# Altium project STM32F4.PrjPcb
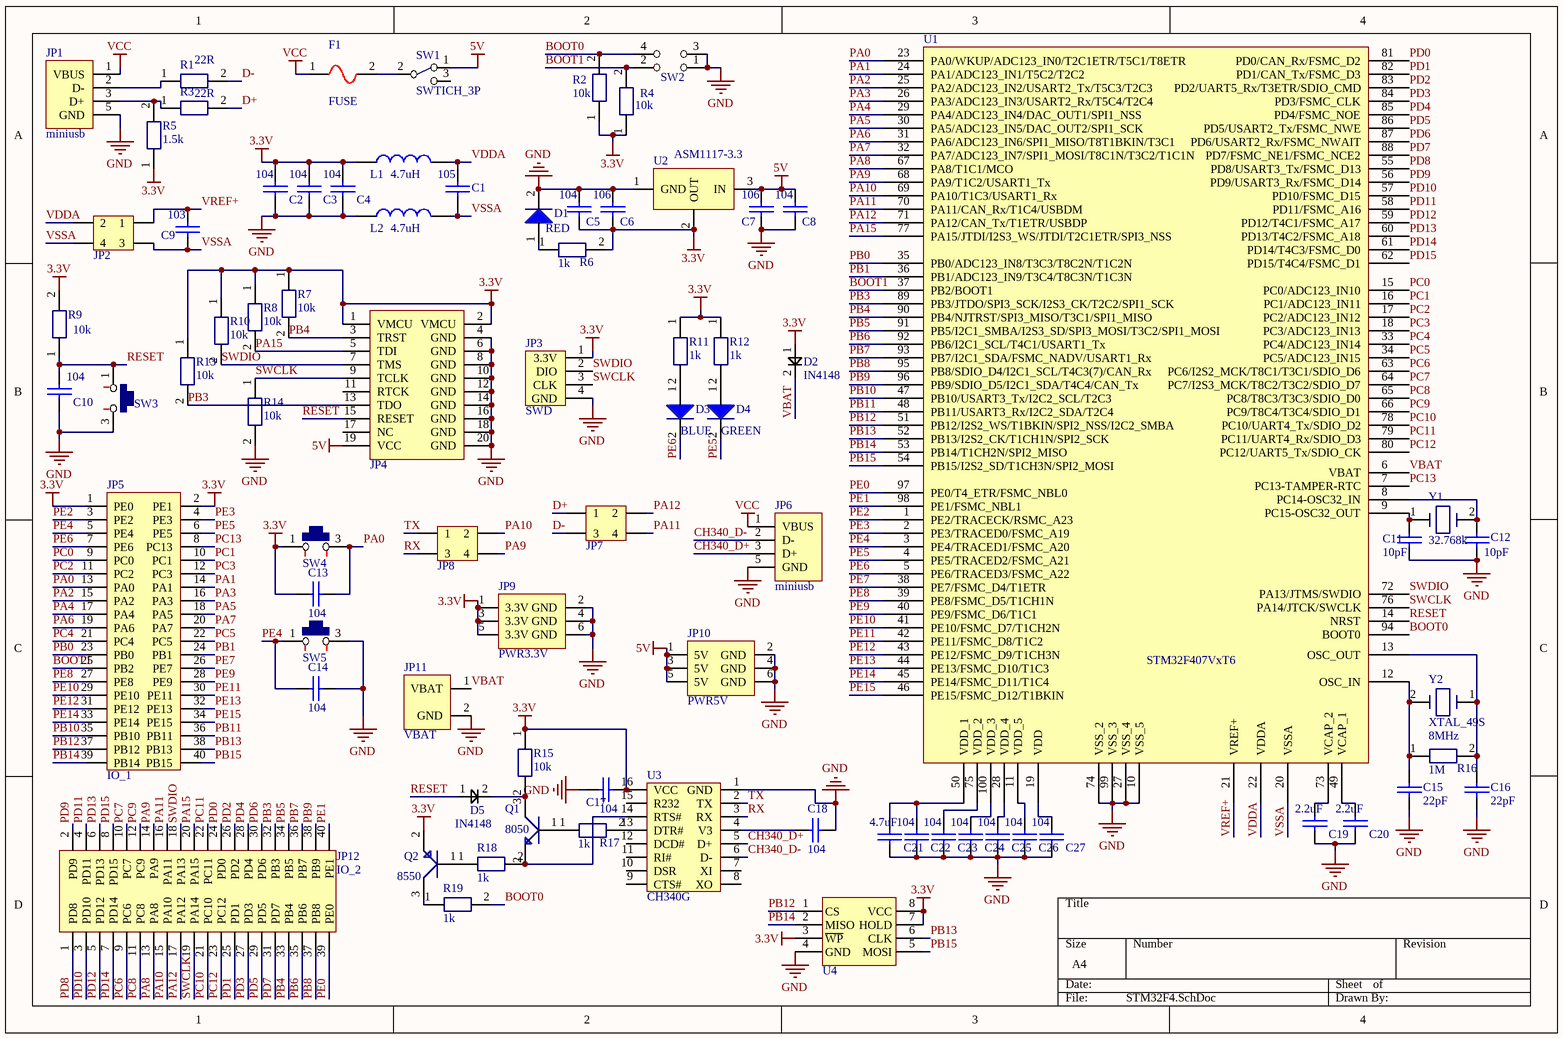
[diagram p0: STM32F4.SchDoc]
1 sheet, 79 parts. Net scope: global (net labels, ports and power ports of the same name join across sheets).
Board files: ST_LOGO.PcbDoc, STM32F4.PcbDoc

## Sheet STM32F4.SchDoc
size A4

### Parts
C1  0805c  [0805C]  (value not drawn)
C2  0805c  [0805C]  (value not drawn)
C3  0805c  [0805C]  (value not drawn)
C4  0805c  [0805C]  (value not drawn)
C5  0805c  [0805C]  (value not drawn)
C6  0805c  [0805C]  (value not drawn)
C7  0805c  [0805C]  (value not drawn)
C8  0805c  [0805C]  (value not drawn)
C9  0805c  [0805C]  (value not drawn)
C10  0805c  [0805C]  (value not drawn)
C11  0805c  [0805C]  (value not drawn)
C12  0805c  [0805C]  (value not drawn)
C13  0805c  [0805C]  (value not drawn)
C14  0805c  [0805C]  (value not drawn)
C15  0805c  [0805C]  (value not drawn)
C16  0805c  [0805C]  (value not drawn)
C17  0805c  [0805C]  (value not drawn)
C18  0805c  [0805C]  (value not drawn)
C19  0805c  [0805C]  (value not drawn)
C20  0805c  [0805C]  (value not drawn)
C21  0805c  [0805C]  (value not drawn)
C22  0805c  [0805C]  (value not drawn)
C23  0805c  [0805C]  (value not drawn)
C24  0805c  [0805C]  (value not drawn)
C25  0805c  [0805C]  (value not drawn)
C26  0805c  [0805C]  (value not drawn)
C27  0805c  [0805C]  (value not drawn)
D1  LED  [0805D]  (value not drawn)
D2  Parameter 1: IN4148  [0805D]  (hidden comment: 0805D)
D3  LED  [0805D]  (value not drawn)
D4  LED  [0805D]  (value not drawn)
D5  Parameter 1: IN4148  [0805D]  (hidden comment: 0805D)
F1  FUSE  [1206R]
JP1  miniusb  [MINI_USB]
JP2  2*2  [CON20VP2R54-2X2TM]  (value not drawn)
JP3  SWD  [SWD]
JP4  JTAG  [JTAG]  (value not drawn)
JP5  IO_1  [IO]
JP6  miniusb  [MINI_USB]
JP7  2*2  [CON20VP2R54-2X2TM]  (value not drawn)
JP8  2*2  [CON20VP2R54-2X2TM]  (value not drawn)
JP9  PWR3.3V  [PWR]
JP10  PWR5V  [PWR]
JP11  VBAT  [VBAT]
JP12  IO_2  [IO]
L1  0805L  [0805L]  (value not drawn)
L2  0805L  [0805L]  (value not drawn)
Q1  8050  [SOT23-3]
Q2  8550  [SOT23-3]
R1  0805r  [0805R]  (value not drawn)
R2  0805r  [0805R]  (value not drawn)
R3  0805r  [0805R]  (value not drawn)
R4  0805r  [0805R]  (value not drawn)
R5  0805r  [0805R]  (value not drawn)
R6  0805r  [0805R]  (value not drawn)
R7  0805r  [0805R]  (value not drawn)
R8  0805r  [0805R]  (value not drawn)
R9  0805r  [0805R]  (value not drawn)
R10  0805r  [0805R]  (value not drawn)
R11  0805r  [0805R]  (value not drawn)
R12  0805r  [0805R]  (value not drawn)
R13  0805r  [0805R]  (value not drawn)
R14  0805r  [0805R]  (value not drawn)
R15  0805r  [0805R]  (value not drawn)
R16  0805r  [0805R]  (value not drawn)
R17  0805r  [0805R]  (value not drawn)
R18  0805r  [0805R]  (value not drawn)
R19  0805r  [0805R]  (value not drawn)
SW1  SWTICH_3P  [SWITCH_3P]
SW2  SW_BOOT  [DAIL-SWITCH]  (value not drawn)
SW3  KEY  [KEY_4P]  (value not drawn)
SW4  KEY  [KEY_4P]  (value not drawn)
SW5  KEY  [KEY_4P]  (value not drawn)
U1  STM32F407VxT6  [LQFP-100_M]
U2  ASM1117-3.3  [SOT223_N]
U3  CH340G  [SOP16]
U4  25Q64  [SOP8]  (value not drawn)
Y1  32.768k  [圆柱晶振2*6]
Y2  XTAL_49S  [XTAL]

### Nets
3.3V: C2.1 C3.1 C4.1 C5.2 C6.2 C13.1 C17.2 D2.1 JP3.1(3.3V) JP4.1(VMCU) JP4.2(VMCU) JP5.1(PE0) JP5.2(PE1) JP9.1(3.3V) JP9.3(3.3V) JP9.5(3.3V) L1.1 Q2.2(E) R2.1 R4.1 R5.1 R6.2 R7.1 R8.1 R9.2 R10.1 R11.1 R12.1 R13.1 R15.1 SW4.1 U2.2(OUT) U3.16(VCC) U4.3(~{WP}) U4.7(HOLD) U4.8(VCC)
5V: C7.1 C8.1 JP4.19(VCC) JP10.1(5V) JP10.3(5V) JP10.5(5V) SW1.1 U2.3(IN)
GND: C2.2 C3.2 C4.2 C5.1 C6.1 C7.2 C8.2 C10.2 C11.2 C12.2 C14.2 C15.2 C16.2 C17.1 C18.2 C19.2 C20.2 C21.2 C22.2 C23.2 C24.2 C25.2 C26.2 C27.2 D1.2 JP1.5(GND) JP3.4(GND) JP4.4(GND) JP4.6(GND) JP4.8(GND) JP4.10(GND) JP4.12(GND) JP4.14(GND) JP4.16(GND) JP4.18(GND) JP4.20(GND) JP6.5(GND) JP9.2(GND) JP9.4(GND) JP9.6(GND) JP10.2(GND) JP10.4(GND) JP10.6(GND) JP11.2(GND) L2.1 R14.2 SW2.1 SW2.3 SW3.3 SW5.3 U1.10(VSS_5) U1.27(VSS_4) U1.74(VSS_2) U1.99(VSS_3) U2.1(GND) U3.1(GND) U4.4(GND)
VCC: F1.1 JP1.1(VBUS) JP6.1(VBUS)
BOOT0: R2.2 R19.2 SW2.4 U1.94(BOOT0)
BOOT1: JP5.25(PB2) R4.2 SW2.2 U1.37(PB2/BOOT1)
CH340_D+: JP6.3(D+) U3.5(D+)
CH340_D-: JP6.2(D-) U3.6(D-)
D+: JP7.1 R3.2
D-: JP7.3 R1.2
PA0: C13.2 JP5.13(PA0) SW4.3 U1.23(PA0/WKUP/ADC123_IN0/T2C1ETR/T5C1/T8ETR)
PA1: JP5.14(PA1) U1.24(PA1/ADC123_IN1/T5C2/T2C2)
PA2: JP5.15(PA2) U1.25(PA2/ADC123_IN2/USART2_Tx/T5C3/T2C3)
PA3: JP5.16(PA3) U1.26(PA3/ADC123_IN3/USART2_Rx/T5C4/T2C4)
PA4: JP5.17(PA4) U1.29(PA4/ADC123_IN4/DAC_OUT1/SPI1_NSS)
PA5: JP5.18(PA5) U1.30(PA5/ADC123_IN5/DAC_OUT2/SPI1_SCK)
PA6: JP5.19(PA6) U1.31(PA6/ADC123_IN6/SPI1_MISO/T8T1BKIN/T3C1)
PA7: JP5.20(PA7) U1.32(PA7/ADC123_IN7/SPI1_MOSI/T8C1N/T3C2/T1C1N)
PA8: JP12.13(PA8) U1.67(PA8/T1C1/MCO)
PA9: JP8.4 JP12.14(PA9) U1.68(PA9/T1C2/USART1_Tx)
PA10: JP8.2 JP12.15(PA10) U1.69(PA10/T1C3/USART1_Rx)
PA11: JP7.4 JP12.16(PA11) U1.70(PA11/CAN_Rx/T1C4/USBDM)
PA12: JP7.2 JP12.17(PA12) U1.71(PA12/CAN_Tx/T1ETR/USBDP)
PA15: JP4.5(TDI) JP12.20(PA15) R8.2 U1.77(PA15/JTDI/I2S3_WS/JTDI/T2C1ETR/SPI3_NSS)
PB0: JP5.23(PB0) U1.35(PB0/ADC123_IN8/T3C3/T8C2N/T1C2N)
PB1: JP5.24(PB1) U1.36(PB1/ADC123_IN9/T3C4/T8C3N/T1C3N)
PB3: JP4.13(TDO) JP12.32(PB3) R13.2 U1.89(PB3/JTDO/SPI3_SCK/I2S3_CK/T2C2/SPI1_SCK)
PB4: JP4.3(TRST) JP12.33(PB4) R7.2 U1.90(PB4/NJTRST/SPI3_MISO/T3C1/SPI1_MISO)
PB5: JP12.34(PB5) U1.91(PB5/I2C1_SMBA/I2S3_SD/SPI3_MOSI/T3C2/SPI1_MOSI)
PB6: JP12.35(PB6) U1.92(PB6/I2C1_SCL/T4C1/USART1_Tx)
PB7: JP12.36(PB7) U1.93(PB7/I2C1_SDA/FSMC_NADV/USART1_Rx)
PB8: JP12.37(PB8) U1.95(PB8/SDIO_D4/I2C1_SCL/T4C3(7)/CAN_Rx)
PB9: JP12.38(PB9) U1.96(PB9/SDIO_D5/I2C1_SDA/T4C4/CAN_Tx)
PB10: JP5.35(PB10) U1.47(PB10/USART3_Tx/I2C2_SCL/T2C3)
PB11: JP5.36(PB11) U1.48(PB11/USART3_Rx/I2C2_SDA/T2C4)
PB12: JP5.37(PB12) U1.51(PB12/I2S2_WS/T1BKIN/SPI2_NSS/I2C2_SMBA) U4.1(CS)
PB13: JP5.38(PB13) U1.52(PB13/I2S2_CK/T1CH1N/SPI2_SCK) U4.6(CLK)
PB14: JP5.39(PB14) U1.53(PB14/T1CH2N/SPI2_MISO) U4.2(MISO)
PB15: JP5.40(PB15) U1.54(PB15/I2S2_SD/T1CH3N/SPI2_MOSI) U4.5(MOSI)
PC0: JP5.9(PC0) U1.15(PC0/ADC123_IN10)
PC1: JP5.10(PC1) U1.16(PC1/ADC123_IN11)
PC2: JP5.11(PC2) U1.17(PC2/ADC123_IN12)
PC3: JP5.12(PC3) U1.18(PC3/ADC123_IN13)
PC4: JP5.21(PC4) U1.33(PC4/ADC123_IN14)
PC5: JP5.22(PC5) U1.34(PC5/ADC123_IN15)
PC6: JP12.9(PC6) U1.63(PC6/I2S2_MCK/T8C1/T3C1/SDIO_D6)
PC7: JP12.10(PC7) U1.64(PC7/I2S3_MCK/T8C2/T3C2/SDIO_D7)
PC8: JP12.11(PC8) U1.65(PC8/T8C3/T3C3/SDIO_D0)
PC9: JP12.12(PC9) U1.66(PC9/T8C4/T3C4/SDIO_D1)
PC10: JP12.21(PC10) U1.78(PC10/UART4_Tx/SDIO_D2)
PC11: JP12.22(PC11) U1.79(PC11/UART4_Rx/SDIO_D3)
PC12: JP12.23(PC12) U1.80(PC12/UART5_Tx/SDIO_CK)
PC13: JP5.8(PC13) U1.7(PC13-TAMPER-RTC)
PD0: JP12.24(PD0) U1.81(PD0/CAN_Rx/FSMC_D2)
PD1: JP12.25(PD1) U1.82(PD1/CAN_Tx/FSMC_D3)
PD2: JP12.26(PD2) U1.83(PD2/UART5_Rx/T3ETR/SDIO_CMD)
PD3: JP12.27(PD3) U1.84(PD3/FSMC_CLK)
PD4: JP12.28(PD4) U1.85(PD4/FSMC_NOE)
PD5: JP12.29(PD5) U1.86(PD5/USART2_Tx/FSMC_NWE)
PD6: JP12.30(PD6) U1.87(PD6/USART2_Rx/FSMC_NWAIT)
PD7: JP12.31(PD7) U1.88(PD7/FSMC_NE1/FSMC_NCE2)
PD8: JP12.1(PD8) U1.55(PD8/USART3_Tx/FSMC_D13)
PD9: JP12.2(PD9) U1.56(PD9/USART3_Rx/FSMC_D14)
PD10: JP12.3(PD10) U1.57(PD10/FSMC_D15)
PD11: JP12.4(PD11) U1.58(PD11/FSMC_A16)
PD12: JP12.5(PD12) U1.59(PD12/T4C1/FSMC_A17)
PD13: JP12.6(PD13) U1.60(PD13/T4C2/FSMC_A18)
PD14: JP12.7(PD14) U1.61(PD14/T4C3/FSMC_D0)
PD15: JP12.8(PD15) U1.62(PD15/T4C4/FSMC_D1)
PE0: JP12.39(PE0) U1.97(PE0/T4_ETR/FSMC_NBL0)
PE1: JP12.40(PE1) U1.98(PE1/FSMC_NBL1)
PE2: JP5.3(PE2) U1.1(PE2/TRACECK/RSMC_A23)
PE3: JP5.4(PE3) U1.2(PE3/TRACED0/FSMC_A19)
PE4: C14.1 JP5.5(PE4) SW5.1 U1.3(PE4/TRACED1/FSMC_A20)
PE5: D4.2 JP5.6(PE5) U1.4(PE5/TRACED2/FSMC_A21)
PE6: D3.2 JP5.7(PE6) U1.5(PE6/TRACED3/FSMC_A22)
PE7: JP5.26(PE7) U1.38(PE7/FSMC_D4/T1ETR)
PE8: JP5.27(PE8) U1.39(PE8/FSMC_D5/T1CH1N)
PE9: JP5.28(PE9) U1.40(PE9/FSMC_D6/T1C1)
PE10: JP5.29(PE10) U1.41(PE10/FSMC_D7/T1CH2N)
PE11: JP5.30(PE11) U1.42(PE11/FSMC_D8/T1C2)
PE12: JP5.31(PE12) U1.43(PE12/FSMC_D9/T1CH3N)
PE13: JP5.32(PE13) U1.44(PE13/FSMC_D10/T1C3)
PE14: JP5.33(PE14) U1.45(PE14/FSMC_D11/T1C4)
PE15: JP5.34(PE15) U1.46(PE15/FSMC_D12/T1BKIN)
RESET: C10.1 D5.1 JP4.15(RESET) R9.1 SW3.1 U1.14(NRST)
RX: JP8.3 U3.3(RX)
SWCLK: JP3.3(CLK) JP4.9(TCLK) JP12.19(PA14) R14.1 U1.76(PA14/JTCK/SWCLK)
SWDIO: JP3.2(DIO) JP4.7(TMS) JP12.18(PA13) R10.2 U1.72(PA13/JTMS/SWDIO)
TX: JP8.1 U3.2(TX)
VBAT: D2.2 JP11.1(VBAT) U1.6(VBAT)
VDDA: C1.1 JP2.2 L1.2 U1.22(VDDA)
VREF+: C9.1 JP2.1 U1.21(VREF+)
VSSA: C1.2 C9.2 JP2.3 JP2.4 L2.2 U1.20(VSSA)
NetC11_1: C11.1 U1.9(PC15-OSC32_OUT) Y1.1
NetC12_1: C12.1 U1.8(PC14-OSC32_IN) Y1.2
NetC15_1: C15.1 R16.1 U1.12(OSC_IN) Y2.2
NetC16_1: C16.1 R16.2 U1.13(OSC_OUT) Y2.1
NetC18_1: C18.1 U3.4(V3)
NetC19_1: C19.1 U1.73(VCAP_2)
NetC20_1: C20.1 U1.49(VCAP_1)
NetC21_1: C21.1 C22.1 U1.50(VDD_1)
NetC23_1: C23.1 U1.75(VDD_2)
NetC24_1: C24.1 U1.100(VDD_3)
NetC25_1: C25.1 U1.28(VDD_4)
NetC26_1: C26.1 U1.11(VDD_5)
NetC27_1: C27.1 U1.19(VDD)
NetD1_1: D1.1 R6.1
NetD3_1: D3.1 R11.2
NetD4_1: D4.1 R12.2
NetD5_2: D5.2 Q1.3(C) R15.2
NetF1_2: F1.2 SW1.2
NetJP1_2: JP1.2(D-) R1.1
NetJP1_3: JP1.3(D+) R3.1 R5.2
NetQ1_1: Q1.1(B) R17.1
NetQ1_2: Q1.2(E) R18.2 U3.14(RTS#)
NetQ2_1: Q2.1(B) R18.1
NetQ2_3: Q2.3(C) R19.1
NetR17_2: R17.2 U3.13(DTR#)

Not connected (* = marked no-connect by the designer): JP4 11(RTCK) 17(NC); SW1 3; U3 7(XI) 8(XO) 9(CTS#) 10(DSR) 11(RI#) 12(DCD#) 15(R232)

### Notes on the sheet
- (in symbol 0805c) 104; 105; 103; 106; 22pF; 10pF; 2.2uF; 4.7uF
- (in symbol 0805L) 4.7uH
- (in symbol 0805r) 22R; 1.5k; 10k; 1k; 1M
- (in symbol LED) RED; BLUE; GREEN
- (in symbol XTAL_49S) 8MHz

### Library data of the parts
SW3-SW5 = KEY_4P
Y1 = 圆柱晶振